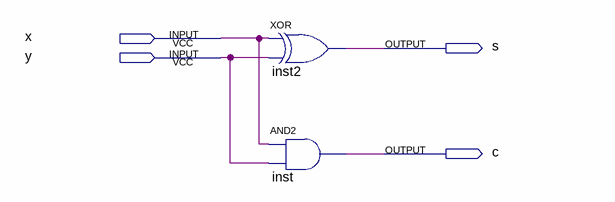
[diagram p0: schematic sheet]
// Quartus schematic MeioSomador.bdf as structural Verilog: 2 symbols, 4 pins
module MeioSomador (
  input  x,
  input  y,
  output s,
  output c
);

  xor inst2 (s, x, y);
  and inst (c, x, y);
endmodule
